# EasyEDA Pro project Force sensor PCB  Easy EDA Proffesional project.epro

# Schematic Schematic1
Create Date: 2025-01-10; Page Name: P1; Project Name: mcu_rs_485_force_sensor_leneralizer; Schematic Name: Schematic1; Update Date: 2025-01-26; Company: EasyEDA.com; Page Size: A4; Version: V1.0
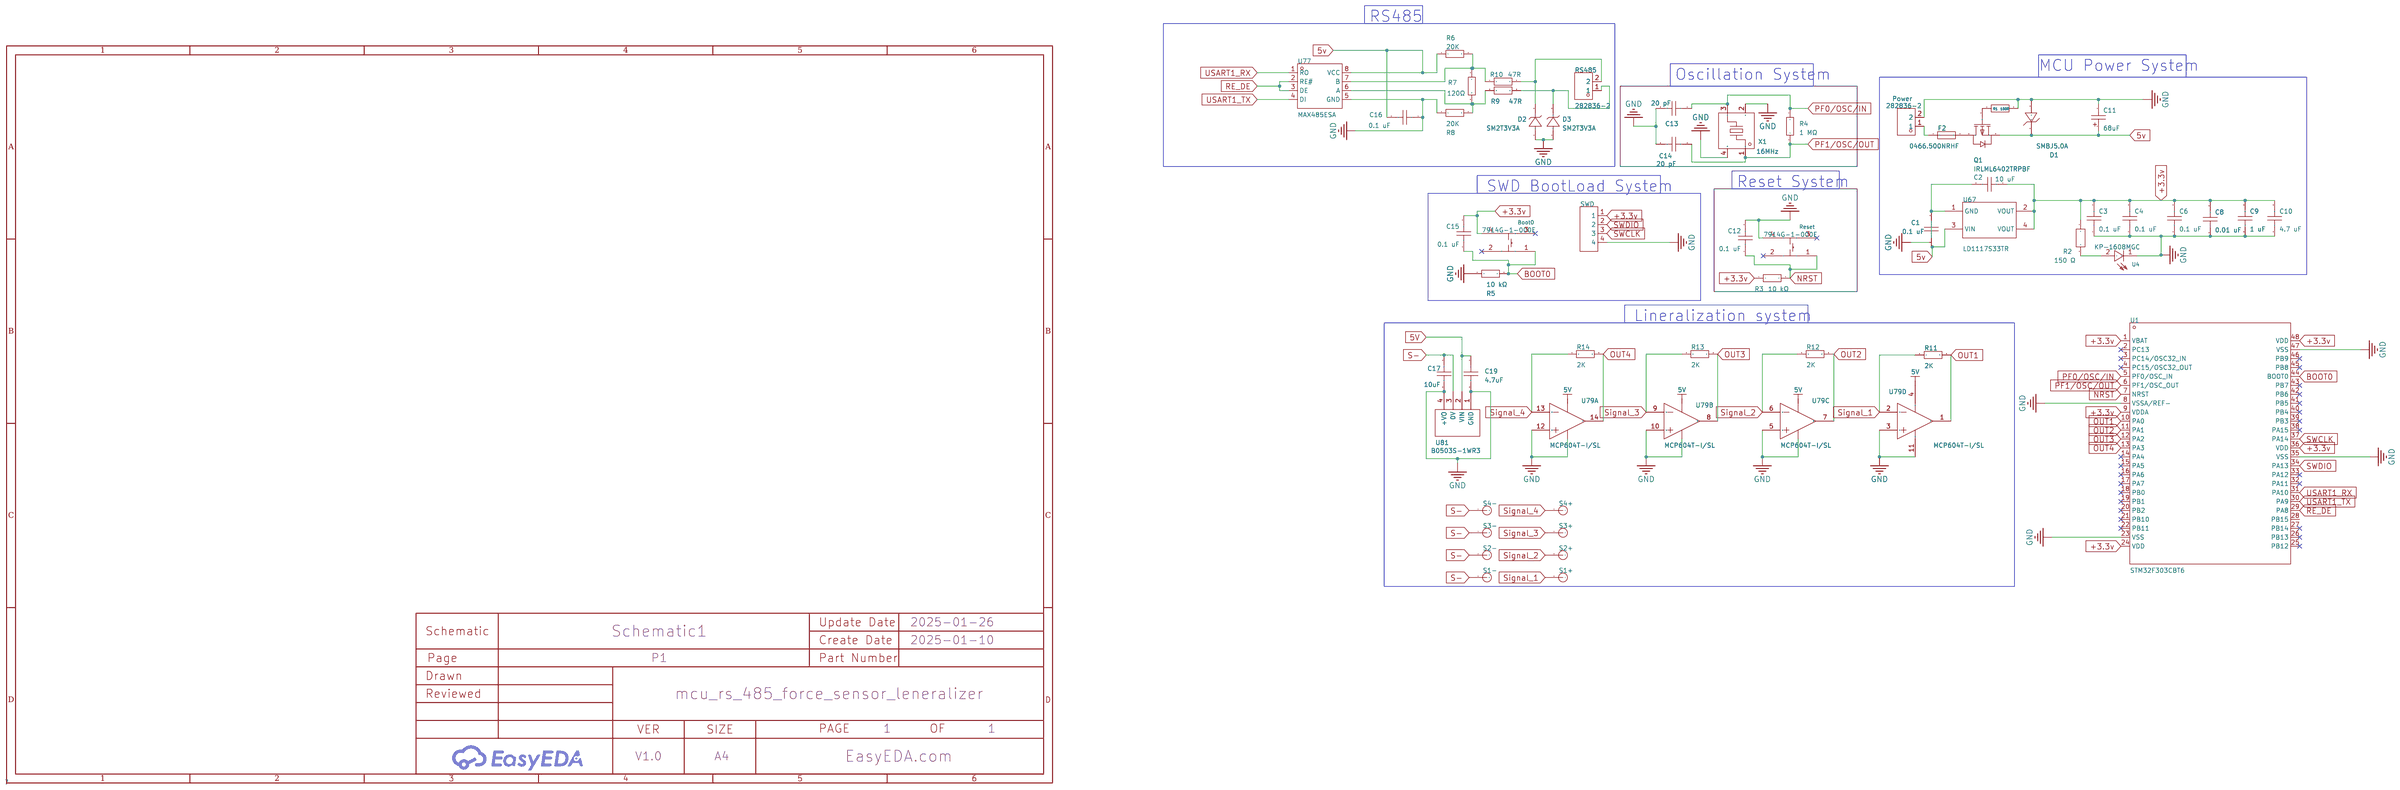
[diagram p0: schematic sheet]

## Parts
Boot0  7914G-1-000E  [KEY-SMD_4P-L5.0-W5.0-P2.54-LS5.5-BL]
C1  0.1 uF  [C0603]
C2  10 uF  [C0603]
C3  0.1 uF  [C0603]
C4  0.1 uF  [C0603]
C6  0.1 uF  [C0603]
C8  0.01 uF  [C0603]
C9  1 uF  [C0603]
C10  4.7 uF  [C0603]
C11  68uF  [CASE-B_3528]
C12  0.1 uF  [C0603]
C13  20 pF  [C0603]
C14  20 pF  [C0603]
C15  0.1 uF  [C0603]
C16  0.1 uF  [C0603]
C17  10uF  [C0603]
C19  4.7uF  [C0603]
D1  SMBJ5.0A  [SMB_L4.3-W3.6-LS5.4-RD]
D2  SM2T3V3A  [DO-216AA_L1.9-W1.9-LS3.8-FD]
D3  SM2T3V3A  [DO-216AA_L1.9-W1.9-LS3.8-FD]
F2  0466.500NRHF  [F1206]
Power  282836-2  [CONN-TH_2P-P5.00_282836-2]
Q1  IRLML6402TRPBF  [SOT-23-3_L2.9-W1.6-P1.90-LS2.8-BR]
R1  100R  [R0603]
R2  150 Ω  [R0805]
R3  10 kΩ  [R0603]
R4  1 MΩ  [R0603]
R5  10 kΩ  [R0603]
R6  20K  [R0603]
R7  120Ω  [R1206]
R8  20K  [R0603]
R9  47R  [R0603]
R10  47R  [R0603]
R11  2K  [R0603]
R12  2K  [R0603]
R13  2K  [R0603]
R14  2K  [R0603]
Reset  7914G-1-000E  [KEY-SMD_4P-L5.0-W5.0-P2.54-LS5.5-BL]
RS485  282836-2  [CONN-TH_2P-P5.00_282836-2]
S1+  -  [robust_pin]
S1-  -  [robust_pin]
S2+  -  [robust_pin]
S2-  -  [robust_pin]
S3+  -  [robust_pin]
S3-  -  [robust_pin]
S4+  -  [robust_pin]
S4-  -  [robust_pin]
SWD  -  [HDR-TH_4P-P2.54-V-M]
U1  STM32F303CBT6  [LQFP-48_L7.0-W7.0-P0.50-LS9.0-BL]
U4  KP-1608MGC  [LED0603-RD_GREEN]
U67  LD1117S33TR  [SOT-223_L6.5-W3.5-P2.30-LS7.0-BR]
U77  MAX485ESA  [SOIC-8_L4.9-W3.9-P1.27-LS6.0-BL]
U79  MCP604T-I/SL  [SOIC-14_L8.7-W3.9-P1.27-LS6.0-BL]  (sections 1,2,3,4)
U81  B0503S-1WR3  [PWRM-TH_B0503S-1WR2]
X1  16MHz  [CRYSTAL-SMD_4P-L5.0-W3.2-BL]

## Library data of the parts
Boot0 Reset = 7914G-1-000E: Circuit:SPST-常开 Actuator Style:Round Button Operating Force:300gf Mounting Style:Brick nogging Contact Current:100mA Voltage Rating (DC):16V IP Rating:IP67 Pin Style:Gull Wing Operating Temperature:-55℃~+125℃ Operating Temperature:-55℃~+125℃; Supplier Part: C840653; Manufacturer: BOURNS; JLCPCB Part Class: Extended Part; Supplier: LCSC; Circuit: SPST-常开; Actuator Style: Round Button; Operating Force: 300gf; Mounting Style: Brick nogging; Contact Current: 100mA; Voltage Rating (DC): 16V; IP Rating: IP67; Pin Style: Gull Wing; Operating Temperature: -55℃~+125℃
C1-C4 C6 C8-C10 C12-C17 C19 = CAP_0603: Supplier Footprint: 0603
C11 = TLJB227M006R0500: Capacitance: Tolerance:±20% Tolerance:±20% Rated Voltage: Equivalent Series Resistance(ESR):500mΩ@100kHz Operating Temperature:-55℃~+125℃ Operating Temperature:-55℃~+125℃; LCSC Part Name: 220uF ±20% 6.3V; Supplier Part: C30242; Manufacturer: Kyocera AVX; Supplier Footprint: CASE-B-3528-21(mm); JLCPCB Part Class: Extended Part; Datasheet: https://atta.szlcsc.com/upload/public/pdf/source/20181016/C313517_95E099C94D57B8A6005DAF15C3058A23.pdf; Supplier: LCSC; Tolerance: ±20%; Equivalent Series Resistance(ESR): 500mΩ@100kHz; Operating Temperature: -55℃~+125℃
D1 = SMBJ5.0A_C782420: Reverse Stand-Off Voltage (Vrwm):5V Maximum Clamping Voltage:9.2V Peak Pulse Current (Ipp)@10/1000us:65.3A Breakdown Voltage:6.4V Reverse Leakage Current (Ir):800uA Type:TVS; Supplier Part: C782420; Manufacturer: SEMBO(深波); Supplier Footprint: SMB(DO-214AA); JLCPCB Part Class: Extended Part; Datasheet: https://atta.szlcsc.com/upload/public/pdf/source/20200914/C782420_BB0DBCD40A47EBCD5666F735198E6B58.pdf; Supplier: LCSC; Reverse Stand-Off Voltage (Vrwm): 5V; Maximum Clamping Voltage: 9.2V; Peak Pulse Current (Ipp)@10/1000us: 65.3A; Breakdown Voltage: 6.4V; Reverse Leakage Current (Ir): 800uA; Type: TVS
D2 D3 = SM2T3V3A: Reverse Stand-Off Voltage (Vrwm):3.3V Maximum Clamping Voltage:6.8V Peak Pulse Current (Ipp)@10/1000us:25A Peak Pulse Power Dissipation (Ppp)@10/1000us:200W Breakdown Voltage:3.6V Reverse Leakage Current (Ir):500uA Type:TVS; LCSC Part Name: 单向TVS 3.3V截止 25A峰值脉冲; Supplier Part: C970557; Manufacturer: ST(意法半导体); Supplier Footprint: DO-216AA; JLCPCB Part Class: Extended Part; Datasheet: https://atta.szlcsc.com/upload/public/pdf/source/20201211/C970557_EBE10214B1FDEDE84815AE73A3ED0A7F.pdf; Supplier: LCSC; Reverse Stand-Off Voltage (Vrwm): 3.3V; Maximum Clamping Voltage: 6.8V; Peak Pulse Current (Ipp)@10/1000us: 25A; Peak Pulse Power Dissipation (Ppp)@10/1000us: 200W; Breakdown Voltage: 3.6V; Reverse Leakage Current (Ir): 500uA; Type: TVS
F2 = 0466.500NRHF: Type:SMD Fuse Current Rating:500mA Voltage Rating  (AC):63V Voltage Rating (DC):63V Operating Temperature:-55℃~+90℃ Operating Temperature:-55℃~+90℃ Breaking Capacity:50A; LCSC Part Name: 63V贴片式保险丝; Supplier Part: C151133; Manufacturer: Littelfuse(美国力特); Supplier Footprint: 1206; JLCPCB Part Class: Extended Part; Datasheet: https://atta.szlcsc.com/upload/public/pdf/source/20171201/C151136_15121178482301156393.pdf; Supplier: LCSC; Type: SMD Fuse; Current Rating: 500mA; Voltage Rating  (AC): 63V; Voltage Rating (DC): 63V; Operating Temperature: -55℃~+90℃; Breaking Capacity: 50A
Power RS485 = 282836-2: Pitch:5mm Color:Green Mounting Style:Direct Insert Current Rating (Max):13.5A Voltage Rating (Max):300V Number of Pins:2P Number of Rows:1 Wire Gauge - AWG:16~30 Wire Gauge - AWG:16~30 Number of PINs Per Row:2; LCSC Part Name: 5mm 排数:1 每排P数:2 直插; Supplier Part: C590402; Manufacturer: TE Connectivity(泰科电子); Supplier Footprint: 插件,P=5mm; JLCPCB Part Class: Extended Part; Datasheet: https://atta.szlcsc.com/upload/public/pdf/source/20240119/1DE6D9456CCE01F1F664469E3029A1B4.pdf; Supplier: LCSC; Pitch: 5mm; Color: Green; Mounting Style: Direct Insert; Current Rating (Max): 13.5A; Voltage Rating (Max): 300V; Number of Pins: 2P; Number of Rows: 1; Wire Gauge - AWG: 16~30; Number of PINs Per Row: 2
Q1 = IRLML6402TRPBF_C2593: Type:1 Piece P-Channel Drain Source Voltage (Vdss): Continuous Drain Current (Id): Drain Source On Resistance (RDS(on)@Vgs,Id):0.065Ω@4.5V,3.7A Power Dissipation (Pd): Gate Threshold Voltage (Vgs(th)@Id):0.55V@250uA Total Gate Charge (Qg@Vgs):12nC Input C; LCSC Part Name: 1个P沟道 耐压:20V 电流:3.7A; Supplier Part: C2593; Manufacturer: Infineon(英飞凌); Supplier Footprint: SOT-23; JLCPCB Part Class: Extended Part; Datasheet: https://atta.szlcsc.com/upload/public/pdf/source/20140818/1457707226203.pdf; Supplier: LCSC; Type: 1 Piece P-Channel; Drain Source On Resistance (RDS(on)@Vgs,Id): 0.065Ω@4.5V,3.7A; Gate Threshold Voltage (Vgs(th)@Id): 0.55V@250uA; Total Gate Charge (Qg@Vgs): 12nC; Input Capacitance (Ciss@Vds): 633pF; Reverse Transfer Capacitance (Crss@Vds): 110pF; Operating Temperature: -55℃~+150℃
R1 R3-R6 R8-R14 = Res_0603: Supplier Footprint: 0603
R2 = ERJ6ENF2053V: Type:Thick Film Resistors Resistance:205kΩ Tolerance:±1% Tolerance:±1% Power(Watts): Overload Voltage (Max):- Temperature Coefficient:±100ppm/℃ Temperature Coefficient:±100ppm/℃ Operating Temperature Range:-55℃~+155℃ Operating Temperature Range:-55℃~+155℃; LCSC Part Name: 205kΩ ±1% 125mW 厚膜电阻; Supplier Part: C2077507; Manufacturer: PANASONIC(松下); Supplier Footprint: 0805; JLCPCB Part Class: Extended Part; Datasheet: https://atta.szlcsc.com/upload/public/pdf/source/20240116/DC5257A3024E44D37E518C2D5EB5F78B.pdf; Supplier: LCSC; Type: Thick Film Resistors; Tolerance: ±1%; Temperature Coefficient: ±100ppm/℃; Operating Temperature Range: -55℃~+155℃
R7 = 1206W4J0121T5E: Type:Thick Film Resistors Resistance: Tolerance:±5% Tolerance:±5% Power(Watts): Overload Voltage (Max): Temperature Coefficient:±100ppm/℃ Temperature Coefficient:±100ppm/℃ Operating Temperature Range:-55℃~+155℃ Operating Temperature Range:-55℃~+155℃; LCSC Part Name: 120Ω ±5% 250mW 厚膜电阻; Supplier Part: C25351; Manufacturer: UNI-ROYAL(厚声); Supplier Footprint: 1206; JLCPCB Part Class: Extended Part; Datasheet: https://atta.szlcsc.com/upload/public/pdf/source/20200306/C422600_1E6D84923E4A46A82E41ADD87F860B5C.pdf; Supplier: LCSC; Type: Thick Film Resistors; Tolerance: ±5%; Temperature Coefficient: ±100ppm/℃; Operating Temperature Range: -55℃~+155℃
S1+ S1- S2+ S2- S3+ S3- S4+ S4- = robust_pin
SWD = HDR-M_2.54_1x4P: Supplier Footprint: Through
U1 = STM32F303CBT6: CPU Core:ARM-M4 CPU Maximum Speed:72MHz Program Storage Size:128KB Program Memory Type:FLASH Number of I/O:37 ADC (Bit):12bit DAC (Bit):12bit Low Voltage Detection Threshold:2V~3.6V Low Voltage Detection Threshold:2V~3.6V Application Area:-; LCSC Part Name: 带DSP和FPU的主流混合信号ARM Cortex-M4 MCU，具有128 KB Flash、72 MHz CPU、MPU、CCM、5 MSPS 12位ADC、PGA和比较器; Supplier Part: C108516; Manufacturer: ST(意法半导体); Supplier Footprint: LQFP-48(7x7); JLCPCB Part Class: Extended Part; Datasheet: https://atta.szlcsc.com/upload/public/pdf/source/20180517/C221513_0E93E775D15BCC140B342DE7CE77539F.pdf; Supplier: LCSC; CPU Core: ARM-M4; CPU Maximum Speed: 72MHz; Program Storage Size: 128KB; Program Memory Type: FLASH; Number of I/O: 37; ADC (Bit): 12bit; DAC (Bit): 12bit; Low Voltage Detection Threshold: 2V~3.6V
U4 = KP-1608MGC: Supplier Part: C598258; Manufacturer: Kingbright; Supplier Footprint: SMD; JLCPCB Part Class: Extended Part; Supplier: LCSC
U67 = LD1117S33TR: Output Type:Fixed Maximum Input Voltage:15V Output Voltage:3.3V Output Voltage:3.3V Output Current:800mA Power Supply Rejection Ratio (PSRR):75dB@(120Hz) Dropout Voltage:1.2V@(800mA) standby current:10mA Feature:Thermal Protection(TSD)；Overcurrent Protect; LCSC Part Name: 可调与固定低压降正电压稳压器; Supplier Part: C86781; Manufacturer: ST(意法半导体); Supplier Footprint: SOT-223; JLCPCB Part Class: Extended Part; Datasheet: https://atta.szlcsc.com/upload/public/pdf/source/20181022/C283467_00098992BB1D287195B66486CE33A2DD.pdf; Supplier: LCSC; Output Type: Fixed; Maximum Input Voltage: 15V; Output Voltage: 3.3V; Output Current: 800mA; Power Supply Rejection Ratio (PSRR): 75dB@(120Hz); Dropout Voltage: 1.2V@(800mA); standby current: 10mA; Feature: Thermal Protection(TSD)；Overcurrent Protection(OCP); Operating Temperature: 0℃~+125℃; Output Polarity: Positive electrode; Number of Outputs: 1
U77 = MAX485ESA_C5279041: Supplier Part: C5279041; Manufacturer: TWGMC(台湾迪嘉); Supplier Footprint: SOP-8; JLCPCB Part Class: Extended Part; Datasheet: https://atta.szlcsc.com/upload/public/pdf/source/20221123/28407831C9A9BE6EF87858D2D3D1ED55.pdf; Supplier: LCSC
U79 = MCP604T-I/SL: Number of Circuits:Quad Gain Bandwidth Product(GBP):2.8MHz Current - Input Bias(Ib):1pA Slew Rate(SR):2.3V/us Output Current:22mA Supply Voltage:2.7V~6V Supply Voltage:2.7V~6V -3db Bandwidth:- Output Type:- Rail to Rail:- Supply Current:230uA Operating Te; Supplier Part: C116582; Manufacturer: MICROCHIP(美国微芯); Supplier Footprint: SOIC-14; JLCPCB Part Class: Extended Part; Datasheet: https://atta.szlcsc.com/upload/public/pdf/source/20170914/C128440_1505359808468967969.pdf; Supplier: LCSC; Number of Circuits: Quad; Gain Bandwidth Product(GBP): 2.8MHz; Current - Input Bias(Ib): 1pA; Slew Rate(SR): 2.3V/us; Output Current: 22mA; Supply Voltage: 2.7V~6V; Supply Current: 230uA; Operating Temperature: -40℃~+85℃
U81 = B0503S-1WR3: Number of channel:1 Power:1W input voltage (Vdc):5V input voltage (Vdc):5V Conversion Efficiency:80% Conversion Efficiency:80% Output Voltage:3.3V Output Voltage:3.3V Output Current (Max):303mA Output Current (Max):303mA Maximum Capacitive Load:1000uF Ins; Supplier Part: C909801; Manufacturer: DEXU(德旭电子); Supplier Footprint: 插件; JLCPCB Part Class: Extended Part; Datasheet: https://atta.szlcsc.com/upload/public/pdf/source/20220506/5C724B602142C8CBB8B399A9C2923D8F.pdf; Supplier: LCSC; Number of channel: 1; Power: 1W; input voltage (Vdc): 5V; Conversion Efficiency: 80%; Output Voltage: 3.3V; Output Current (Max): 303mA; Maximum Capacitive Load: 1000uF; Insulated Voltage: 1500V
X1 = HY13MSMD50324POB1R10: Frequency: External load capacitor:20pF Frequency Stability(Full temperature range):±10ppm Frequency Stability(Full temperature range):±10ppm Equivalent Series Resistance (ESR):50Ω; LCSC Part Name: 13MHz 20pF; Supplier Part: C7275144; Manufacturer: Huiyuan crystal(惠源晶工); Supplier Footprint: SMD5032-4P; JLCPCB Part Class: Extended Part; Datasheet: https://atta.szlcsc.com/upload/public/pdf/source/20230530/D0430CADBE2CD60CA30268FC8461A922.pdf; Supplier: LCSC; External load capacitor: 20pF; Frequency Stability(Full temperature range): ±10ppm; Equivalent Series Resistance (ESR): 50Ω

## Nets
5v: C1.1 C11.1 C16.2 D1.1(C) Q1.2(S) R6.1 U67.3(VIN) U77.8(VCC)
5V: C19.1 U79.4(VDD) U81.2(VIN)
+3.3v: Boot0.4 C2.1 C3.2 C4.2 C6.2 C8.2 C9.2 C10.2 C15.2 R2.1 R3.1 SWD.1 U1.1(VBAT) U1.9(VDDA) U1.24(VDD) U1.36(VDD) U1.48(VDD) U67.2(VOUT) U67.4(VOUT)
GND: C1.2 C2.2 C3.1 C4.1 C6.1 C8.1 C9.1 C10.1 C11.2 C12.2 C13.2 C14.2 C16.1 C17.2 C19.2 D1.2(A) D2.1(A) D3.1(A) Power.2 R1.2 R5.1 R8.1 Reset.4 SWD.4 U1.8(VSSA/REF-) U1.23(VSS) U1.35(VSS) U1.47(VSS) U4.1(C) U67.1(GND) U77.5(GND) U79.3(VINA+) U79.5(VINB+) U79.10(VINC+) U79.11(VSS) U79.12(VIND+) U81.1(GND) U81.4(+VO) X1.2(GND) X1.4(GND)
BOOT0: Boot0.1 C15.1 R5.2 U1.44(BOOT0)
NRST: C12.1 R3.2 Reset.1 U1.7(NRST)
OUT1: R11.2 U1.10(PA0) U79.1(VOUTA)
OUT2: R12.2 U1.11(PA1) U79.7(VOUTB)
OUT3: R13.2 U1.12(PA2) U79.8(VOUTC)
OUT4: R14.2 U1.13(PA3) U79.14(VOUTD)
PF0/OSC/IN: C13.1 R4.1 U1.5(PF0/OSC_IN) X1.3
PF1/OSC/OUT: C14.1 R4.2 U1.6(PF1/OSC_OUT) X1.1
RE_DE: U1.29(PA8) U77.2(RE#) U77.3(DE)
S-: C17.1 S1-.1 S2-.1 S3-.1 S4-.1 U81.3(0V)
Signal_1: R11.1 S1+.1 U79.2(VINA-)
Signal_2: R12.1 S2+.1 U79.6(VINB-)
Signal_3: R13.1 S3+.1 U79.9(VINC-)
Signal_4: R14.1 S4+.1 U79.13(VIND-)
SWCLK: SWD.3 U1.37(PA14)
SWDIO: SWD.2 U1.34(PA13)
USART1_RX: U1.31(PA10) U77.1(RO)
USART1_TX: U1.30(PA9) U77.4(DI)
$1N1376: R2.2 U4.2(A)
$1N1378: F2.1 Power.1
$1N1384: Q1.1(G) R1.1
$1N2474: D2.2(K) R10.2 RS485.2
$1N2476: R7.2 R8.2 R9.1 U77.6(A)
$1N2482: D3.2(K) R9.2 RS485.1
$1N2483: R6.2 R7.1 R10.1 U77.7(B)
$1N9830: F2.2 Q1.3(D)

Not connected (* = marked no-connect by the designer): Boot0 2* 3*; Reset 2* 3*; U1 2(PC13)* 3(PC14/OSC32_IN)* 4(PC15/OSC32_OUT)* 14(PA4)* 15(PA5)* 16(PA6)* 17(PA7)* 18(PB0)* 19(PB1)* 20(PB2)* 21(PB10)* 22(PB11)* 25(PB12)* 26(PB13)* 27(PB14)* 28(PB15) 32(PA11)* 33(PA12)* 38(PA15)* 39(PB3)* 40(PB4)* 41(PB5)* 42(PB6)* 43(PB7)* 45(PB8)* 46(PB9)*

## Notes on the sheet
- RS485
- MCU Power System
- Oscillation System
- Reset System
- SWD BootLoad System
- Lineralization system

# Board PCB1
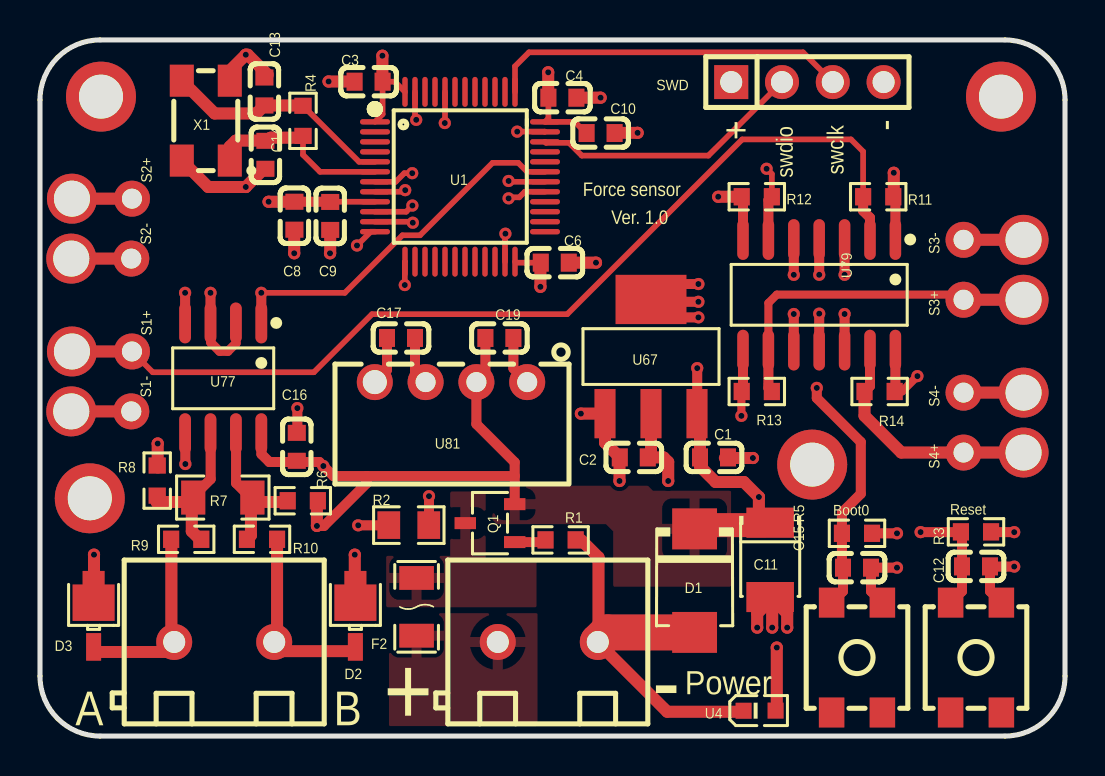
[diagram p1: board, top side]
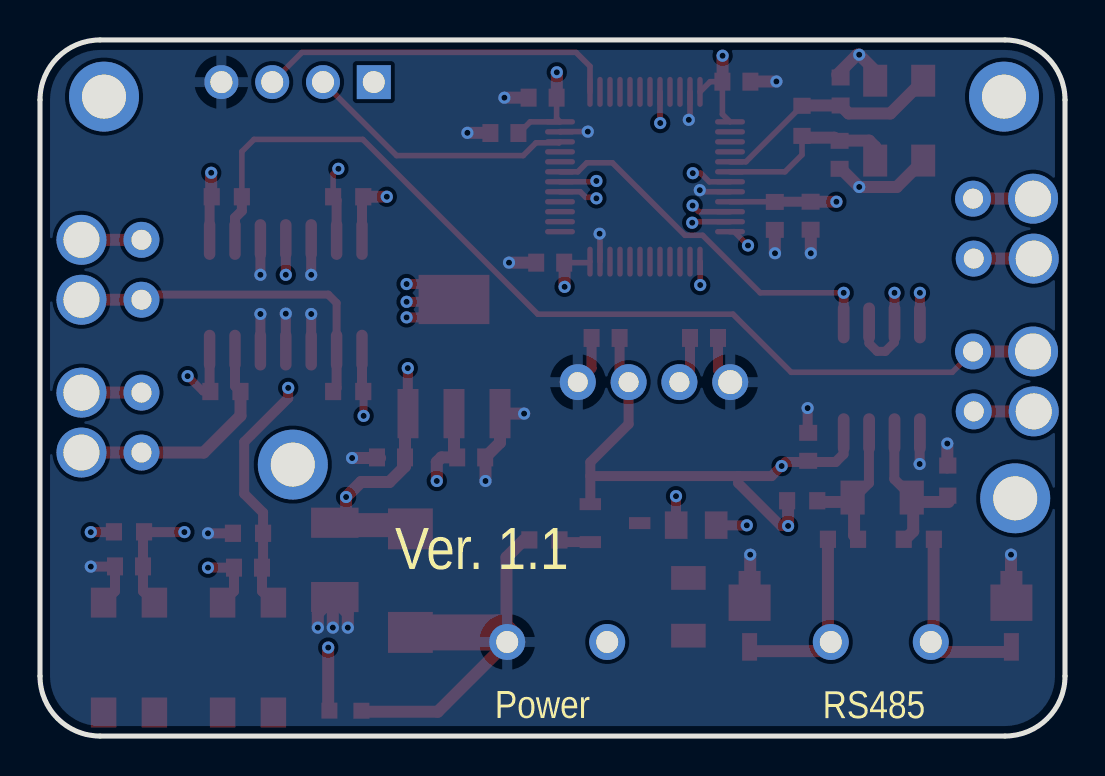
[diagram p2: board, bottom side, seen from below]

Outline 51.25 x 34.85 mm; copper layers: Top Layer, Inner1, Inner2, Bottom Layer. Coordinates in mm from the lower left corner of the outline.
Outline path: 0,31.85 0,3 arc(0.88,0.88) 3,0 48.25,0 arc(50.37,0.88) 51.25,3 51.25,31.85 arc(50.37,33.97) 48.25,34.85 3,34.85 arc(0.88,33.97) 0,31.85
Stack: Top Layer 0.035mm 外层铜厚1oz / Dielectric1 0.2104mm 7628 RC49% 8.6mil / Inner1 0.0152mm 内层铜厚 / Dielectric2 1.065mm 1.1mm H/HOZ 含铜 / Inner2 0.0152mm 内层铜厚 / Dielectric3 0.2104mm 7628 RC49% 8.6mil / Bottom Layer 0.035mm 外层铜厚1oz

## Design rules (mm)
template: JLCPCB Capability(Two Layers Board)
spacing copperThickness1oz (default): track to track 0.102, other pairs 0.152 to 0.3
spacing copperThickness2oz: track to track 0.203, other pairs 0.152 to 0.3
track width copperThickness1oz (default): min 0.127, default 0.254, max 2.54
track width copperThickness2oz: min 0.203, default 0.254, max 2.54
differential pair differentialPair (default): width min 0.127, default 0.254, max 2.54; gap min 0.152, default 0.152
via viaSize (default): diameter min 0.5, default 0.61, max 10; hole min 0.3, default 0.305, max 6.3

## Placement (name value [footprint] x y rotation side)
Boot0  7914G-1-000E  [KEY-SMD_4P-L5.0-W5.0-P2.54-LS5.5-BL]  40.85 3.93 270 top
C1  0.1 uF  [C0603]  33.7 13.95 0 top
C2  10 uF  [C0603]  29.69 13.95 180 top
C3  0.1 uF  [C0603]  16.43 32.76 0 top
C4  0.1 uF  [C0603]  26.12 31.96 180 top
C6  0.1 uF  [C0603]  25.74 23.7 180 top
C8  0.01 uF  [C0603]  12.72 26.05 90 top
C9  1 uF  [C0603]  14.51 26.04 90 top
C10  4.7 uF  [C0603]  28.03 30.19 180 top
C11  68uF  [CASE-B_3528]  36.51 8.82 270 top
C12  0.1 uF  [C0603]  46.8 8.49 0 top
C13  20 pF  [C0603]  11.22 32.27 90 top
C14  20 pF  [C0603]  11.27 29.1 270 top
C15  0.1 uF  [C0603]  40.85 8.43 0 top
C16  0.1 uF  [C0603]  12.84 14.48 270 top
C17  10uF  [C0603]  18.05 19.93 180 top
C19  4.7uF  [C0603]  22.97 19.93 0 top
D1  SMBJ5.0A  [smb_l4.3-w3.6-ls5.4-rd]  32.73 7.78 270 top
D2  SM2T3V3A  [DO-216AA_L1.9-W1.9-LS3.8-FD]  15.77 5.74 270 top
D3  SM2T3V3A  [DO-216AA_L1.9-W1.9-LS3.8-FD]  2.68 5.74 270 top
F2  0466.500NRHF  [f1206]  18.83 6.47 90 top
NOREF  -  [Pad_e2410]  3.05 32.01 0 top
NOREF#2  -  [Pad_e2411]  48.05 32.01 0 top
NOREF#3  -  [Pad_e2413]  38.61 13.59 0 top
NOREF#4  -  [Pad_e2412]  2.49 11.9 0 top
Power  282836-2  [conn-th_2p-p5.00_282836-2]  25.39 4.71 0 top
Q1  IRLML6402TRPBF  [sot-23-3_l2.9-w1.6-p1.90-ls2.8-br]  22.5 10.66 0 top
R1  100R  [R0603]  26.03 9.82 0 top
R2  150 Ω  [R0805]  18.44 10.56 0 top
R3  10 kΩ  [R0603]  46.8 10.22 180 top
R4  1 MΩ  [R0603]  13.15 30.8 270 top
R5  10 kΩ  [R0603]  40.85 10.15 180 top
R6  20K  [R0603]  13.14 11.78 180 top
R7  120Ω  [R1206]  9.14 11.94 180 top
R8  20K  [R0603]  5.86 12.79 270 top
R9  47R  [R0603]  7.31 9.85 180 top
R10  47R  [R0603]  11.1 9.85 0 top
R11  2K  [R0603]  41.91 27 0 top
R12  2K  [R0603]  35.84 27 180 top
R13  2K  [R0603]  35.84 17.25 180 top
R14  2K  [R0603]  41.98 17.25 0 top
Reset  7914G-1-000E  [KEY-SMD_4P-L5.0-W5.0-P2.54-LS5.5-BL]  46.8 3.93 270 top
RS485  282836-2  [CONN-TH_2P-P5.00_282836-2]  9.21 4.71 0 top
S1+  -  [robust_pin]  4.6 19.25 90 top
S1-  -  [robust_pin]  4.56 16.25 90 top
S2+  -  [robust_pin]  4.6 26.9 90 top
S2-  -  [robust_pin]  4.56 23.9 90 top
S3+  -  [robust_pin]  46.18 21.84 270 top
S3-  -  [robust_pin]  46.18 24.84 270 top
S4+  -  [robust_pin]  46.18 14.19 270 top
S4-  -  [robust_pin]  46.18 17.19 270 top
SWD  -  [hdr-th_4p-p2.54-v-m]  38.37 32.74 0 top
U1  STM32F303CBT6  [LQFP-48_L7.0-W7.0-P0.50-LS9.0-BL]  21 28 270 top
U4  KP-1608MGC  [LED0603-RD_GREEN]  35.98 1.27 0 top
U67  LD1117S33TR  [SOT-223_L6.5-W3.5-P2.30-LS7.0-BR]  30.55 19 270 top
U77  MAX485ESA  [SOIC-8_L4.9-W3.9-P1.27-LS6.0-BL]  9.16 17.91 180 top
U79  MCP604T-I/SL  [SOIC-14_L8.7-W3.9-P1.27-LS6.0-BL]  38.96 22.09 180 top
U81  B0503S-1WR3  [pwrm-th_b0503s-1wr2]  20.55 17.72 180 top
X1  16MHz  [CRYSTAL-SMD_4P-L5.0-W3.2-BL]  8.29 30.81 90 top

## Footprints (pads in the part's own frame, mm; a bottom-side part is the same pattern mirrored in y, then rotated)
C0603
  rect 0.8x0.9 smd: 1(-0.7,0) 2(0.7,0)
CASE-B_3528
  rect 1.506x2.376 smd: 1(-1.861,0) 2(1.861,0)
CONN-TH_2P-P5.00_282836-2
  round 1.8 hole 1.1: 1(-2.5,0) 2(2.5,0)
conn-th_2p-p5.00_282836-2
  round 1.8 hole 1.1: 1(-2.5,0) 2(2.5,0)
CRYSTAL-SMD_4P-L5.0-W3.2-BL
  rect 1.6x1.2 smd: 1(-2,-1.2) 2(2,-1.2) 3(2,1.2) 4(-2,1.2)
DO-216AA_L1.9-W1.9-LS3.8-FD
  custom 2.5x2.1 smd: 1(-1.276,0)
  rect 1.38x0.75 smd: 2(1.276,0)
f1206
  rect 1.19x1.728 smd: 1(-1.445,0) 2(1.445,0)
hdr-th_4p-p2.54-v-m
  rect 1.7x1.7 hole 1.1: 1(-3.81,0)
  round 1.7 hole 1.1: 2(-1.27,0) 3(1.27,0) 4(3.81,0)
KEY-SMD_4P-L5.0-W5.0-P2.54-LS5.5-BL
  rect 1.5x1.273 smd: 1(-2.75,-1.27) 2(2.75,-1.27) 3(2.75,1.27) 4(-2.75,1.27)
LED0603-RD_GREEN
  rect 0.8x0.8 smd: 1(-0.799,-0.004) 2(0.799,0.004)
LQFP-48_L7.0-W7.0-P0.50-LS9.0-BL
  oval 0.27x1.5 smd: 1(-2.75,-4.25) 2(-2.25,-4.25) 3(-1.75,-4.25) 4(-1.25,-4.25) 5(-0.75,-4.25) 6(-0.25,-4.25) 7(0.25,-4.25) 8(0.75,-4.25) 9(1.25,-4.25) 10(1.75,-4.25) 11(2.25,-4.25) 12(2.75,-4.25) 25(2.75,4.25) 26(2.25,4.25) 27(1.75,4.25) 28(1.25,4.25) 29(0.75,4.25) 30(0.25,4.25) 31(-0.25,4.25) 32(-0.75,4.25) 33(-1.25,4.25) 34(-1.75,4.25) 35(-2.25,4.25) 36(-2.75,4.25)
  oval 1.5x0.27 smd: 13(4.25,-2.75) 14(4.25,-2.25) 15(4.25,-1.75) 16(4.25,-1.25) 17(4.25,-0.75) 18(4.25,-0.25) 19(4.25,0.25) 20(4.25,0.75) 21(4.25,1.25) 22(4.25,1.75) 23(4.25,2.25) 24(4.25,2.75) 37(-4.25,2.75) 38(-4.25,2.25) 39(-4.25,1.75) 40(-4.25,1.25) 41(-4.25,0.75) 42(-4.25,0.25) 43(-4.25,-0.25) 44(-4.25,-0.75) 45(-4.25,-1.25) 46(-4.25,-1.75) 47(-4.25,-2.25) 48(-4.25,-2.75)
Pad_e2410
  round 3.5 hole 2.2: 65(0,0)
Pad_e2411
  round 3.5 hole 2.2: 65(0,0)
Pad_e2412
  round 3.5 hole 2.2: 65(0,0)
Pad_e2413
  round 3.5 hole 2.2: 65(0,0)
pwrm-th_b0503s-1wr2
  round 1.8 hole 1: 1(-3.81,0) 2(-1.27,0) 3(1.27,0)
  round 1.8 hole 1.2: 4(3.81,0)
R0603
  rect 0.806x0.864 smd: 1(-0.753,0) 2(0.753,0)
R0805
  rect 1.133x1.377 smd: 1(-1,0) 2(1,0)
R1206
  rect 1.208x1.701 smd: 1(-1.479,0) 2(1.479,0)
robust_pin
  round 2.5 hole 1.8x1.55: 1(0,3)
  round 1.8 hole 1: 2(0,0)
smb_l4.3-w3.6-ls5.4-rd
  rect 2.047x2.241 smd: 1(-2.591,0) 2(2.591,0)
SOIC-8_L4.9-W3.9-P1.27-LS6.0-BL
  oval 0.588x2.045 smd: 1(-1.905,-2.772) 2(-0.635,-2.772) 3(0.635,-2.772) 4(1.905,-2.772) 5(1.905,2.772) 6(0.635,2.772) 7(-0.635,2.772) 8(-1.905,2.772)
SOIC-14_L8.7-W3.9-P1.27-LS6.0-BL
  oval 0.574x2.038 smd: 1(-3.81,-2.769) 2(-2.54,-2.769) 3(-1.27,-2.769) 4(0,-2.769) 5(1.27,-2.769) 6(2.54,-2.769) 7(3.81,-2.769) 8(3.81,2.769) 9(2.54,2.769) 10(1.27,2.769) 11(0,2.769) 12(-1.27,2.769) 13(-2.54,2.769) 14(-3.81,2.769)
sot-23-3_l2.9-w1.6-p1.90-ls2.8-br
  rect 1.07x0.6 smd: 1(1.235,-0.95) 2(1.235,0.95) 3(-1.235,0)
SOT-223_L6.5-W3.5-P2.30-LS7.0-BR
  rect 2.465x1.05 smd: 1(2.857,-2.3) 2(2.857,0) 3(2.857,2.3)
  rect 2.465x3.54 smd: 4(-2.857,0)

## Nets
5V: C1.1 C11.1 C16.2 C19.1 D1.1 Q1.2 R6.1 U67.3 U77.8 U79.4 U81.2
+3.3V: Boot0.4 C2.1 C3.2 C4.2 C6.2 C8.2 C9.2 C10.2 C15.2 R2.1 R3.1 SWD.1 U1.1 U1.9 U1.24 U1.36 U1.48 U67.2 U67.4
GND: C1.2 C2.2 C3.1 C4.1 C6.1 C8.1 C9.1 C10.1 C11.2 C12.2 C13.2 C14.2 C16.1 C17.2 C19.2 D1.2 D2.1 D3.1 Power.2 R1.2 R5.1 R8.1 Reset.4 SWD.4 U1.8 U1.23 U1.35 U1.47 U4.1 U67.1 U77.5 U79.3 U79.5 U79.10 U79.11 U79.12 U81.1 U81.4 X1.2 X1.4
BOOT0: Boot0.1 C15.1 R5.2 U1.44
NRST: C12.1 R3.2 Reset.1 U1.7
OUT1: R11.2 U1.10 U79.1
OUT2: R12.2 U1.11 U79.7
OUT3: R13.2 U1.12 U79.8
OUT4: R14.2 U1.13 U79.14
PF0/OSC/IN: C13.1 R4.1 U1.5 X1.3
PF1/OSC/OUT: C14.1 R4.2 U1.6 X1.1
RE_DE: U1.29 U77.2 U77.3
S-: C17.1 S1-.1 S1-.2 S2-.1 S2-.2 S3-.1 S3-.2 S4-.1 S4-.2 U81.3
SIGNAL_1: R11.1 S1+.1 S1+.2 U79.2
SIGNAL_2: R12.1 S2+.1 S2+.2 U79.6
SIGNAL_3: R13.1 S3+.1 S3+.2 U79.9
SIGNAL_4: R14.1 S4+.1 S4+.2 U79.13
SWCLK: SWD.3 U1.37
SWDIO: SWD.2 U1.34
USART1_RX: U1.31 U77.1
USART1_TX: U1.30 U77.4
$1N1376: R2.2 U4.2
$1N1378: F2.1 Power.1
$1N1384: Q1.1 R1.1
$1N2474: D2.2 R10.2 RS485.2
$1N2476: R7.2 R8.2 R9.1 U77.6
$1N2482: D3.2 R9.2 RS485.1
$1N2483: R6.2 R7.1 R10.1 U77.7
$1N9830: F2.2 Q1.3

Pads without a net: Boot0 2 3; NOREF 65; NOREF#2 65; NOREF#3 65; NOREF#4 65; Reset 2 3; U1 2 3 4 14 15 16 17 18 19 20 21 22 25 26 27 28 32 33 38 39 40 41 42 43 45 46

## Via types
v1: diameter 0.61, hole 0.305, Top Layer to Bottom Layer, 66 vias

## Routing (per net, layer and track width the routed paths; a pad name or vN(x,y) marks a point on that pad's centre or on a via; arc(x,y) is an arc through that point)
5V: length 53
  Top Layer w0.5: v1(32.86,18.42) 32.86,16.15 U67.3 ; 11.07,15.15 11.07,14.11 11.47,13.72 13.97,13.72 v1(14.17,13.52) 14.67,13.02 16.34,13.02 ; 23.74,13.02 23.74,13.7 21.82,15.62 U81.2 22.27,18.17 C19.1 ; 23.74,13.02 Q1.2 ; 23.74,13.02 16.34,13.02 ; 16.34,13.02 16.34,12.66 14.2,10.52 v1(13.85,10.52) ; U79.4 v1(38.96,23.09)
  Top Layer w0.6: 36.69,10.87 C11.1 ; U67.3 33,15.99 C1.1 33,13.5 33.78,12.72 35.19,12.72 v1(35.94,11.97) 35.94,11.27 36.45,10.77 ; 13.85,11.72 v1(13.85,10.52)
  Top Layer w0.8: 32.7,10.56 32.49,10.77 ; 36.45,10.77 36.24,10.56
  Top Layer w1.2: 36.24,10.56 32.7,10.56
  Inner2 w0.5: v1(38.96,23.09) 37.94,22.07 35.79,22.07 32.86,19.14 v1(32.86,18.42)
+3.3V: length 35.7
  Top Layer w0.28: U1.1 17.13,31.13 C3.2 17.74,32.76 U1.48 ; C4.2 25.42,30.92 U1.36 26.74,30.75 27.29,30.2 ; C6.2 23.8,23.7 U1.24 ; C9.2 14.52,26.75 U1.9
  Top Layer w0.5: 30.82,21.59 30.97,21.74 32.95,21.74 ; 30.82,21.59 U67.4 30.41,22 31.04,22.63 v1(32.92,22.63) ; 30.82,21.59 31.45,20.96 32.93,20.96 ; C9.2 14.5,26.75 C8.2 ; v1(15.91,10.55) 17.43,10.55 R2.1 ; v1(42.85,8.43) C15.2 41.55,7.25 Boot0.4 ; v1(48.71,10.21) 47.57,10.21 R3.1
  Top Layer w0.6: C6.2 25.02,23.68 v1(25.02,22.49) ; C4.2 25.41,31.97 v1(25.41,33.23) ; U67.2 30.55,14.11 C2.1 31.18,13.95 31.41,13.72 v1(31.41,12.77) ; C3.2 17.12,32.77 v1(17.12,34.06) ; v1(11.43,26.75) C8.2
  vias: v1(32.92,21.74) v1(32.92,20.96)
GND: length 78.2
  Top Layer w0.28: v1(23.27,25.15) 23.25,25.13 U1.23 ; U1.8 18.18,27.25 v1(18.26,27.33) ; v1(23.86,30.26) 25.24,30.26 U1.35 ; U1.47 18.75,30.91 v1(18.81,30.85)
  Top Layer w0.5: v1(12.87,16.42) 12.87,15.12 ; v1(37.69,23.09) U79.5 ; U79.10 v1(37.69,21.13) ; 7.26,15.15 7.27,15.14 v1(7.27,13.62) ; C19.2 23.67,18.41 U81.1 ; v1(48.71,8.48) 47.51,8.48 C12.2 47.5,7.25 Reset.4 ; v1(42.85,10.15) R5.1 ; U81.4 17.35,18.33 C17.2 ; U79.11 v1(38.96,21.15) ; U79.3 v1(40.23,23.09) ; U79.12 v1(40.23,21.13)
  Top Layer w0.6: 27.93,4.75 27.93,8.95 27.05,9.82 ; 27.93,4.75 27.93,4.65 31.36,1.22 35.22,1.22 ; 27.93,4.75 Power.2 ; v1(5.89,14.64) 5.89,13.44 ; v1(36.61,5.43) 36.61,6.89 ; 36.61,6.89 35.86,6.14 v1(35.86,5.43) ; 36.61,6.89 37.36,6.14 v1(37.36,5.43) ; v1(29.88,30.2) 28.69,30.2 ; 34.25,13.92 v1(35.65,13.92) ; v1(14.43,32.77) 15.72,32.77 C3.1 ; v1(27.04,16.14) U67.1 28.25,14.69 C2.2 28.97,13.94 v1(28.97,12.77) ; C9.1 14.51,24.18 v1(14.5,24.17) ; v1(2.7,9.08) 2.7,7.04 D3.1 ; X1.4 8.41,27.49 v1(10.29,27.49) 11.21,28.41 11.39,28.41 ; v1(12.71,24.17) 12.71,25.34 C8.1 ; X1.2 9.49,33.31 v1(10.29,34.11) 10.39,34.11 11.39,33.11 ; v1(15.74,9.08) 15.74,7.59 15.71,7.59 ; v1(27.8,23.7) C6.1 ; v1(28.03,31.96) C4.1
  Top Layer w1.8: D1.2 28.37,5.19 27.93,4.75
BOOT0: length 51.3
  Top Layer w0.28: v1(20.24,30.69) 20.25,30.7 U1.44
  Top Layer w0.5: v1(38.84,17.43) 38.84,16.92 41.04,14.72 41.04,12.13 40.1,11.19 R5.2 40.1,8.48 C15.1 40.15,7.25 Boot0.1
  Inner2 w0.5: v1(20.24,30.69) 21.88,30.69 23.22,29.35 42.81,29.35 43.64,28.52 43.64,23.43 38.84,18.63 v1(38.84,17.43)
NRST: length 65.5
  Top Layer w0.28: v1(18.61,28.18) 18.21,28.18 17.78,27.75 U1.7
  Top Layer w0.5: Reset.1 46.1,7.25 C12.1 46.1,10.17 R3.2 46.03,10.21 v1(44.03,10.21)
  Inner2 w0.5: v1(44.03,10.21) 44.03,8.23 38.99,3.19 21.8,3.19 17.95,7.04 17.95,13.45 13.67,17.73 13.67,24.88 16.97,28.18 v1(18.61,28.18)
OUT1: length 31.1
  Top Layer w0.28: v1(18.62,26.56) 18.31,26.25 U1.10
  Top Layer w0.5: R11.2 42.77,26.89 U79.1
  Top Layer w0.6: R11.2 42.69,27.03 v1(42.69,28.2)
  Inner2 w0.5: v1(18.62,26.56) 19.18,26.56 19.74,26 31.35,26 33.29,27.94 35,27.94 35.58,27.36 41.85,27.36 v1(42.69,28.2)
OUT2: length 23
  Top Layer w0.28: U1.11 18.59,25.75 v1(18.64,25.7)
  Top Layer w0.5: R12.2 35.15,26.94 U79.7
  Top Layer w0.6: v1(33.91,27) R12.2
  Inner2 w0.5: v1(18.64,25.7) 21.02,23.32 23.71,23.32 25.11,24.72 31.63,24.72 v1(33.91,27)
OUT3: length 29.8
  Top Layer w0.28: U1.12 16.54,25.25 v1(15.85,24.56)
  Top Layer w0.4: v1(35.07,16.03) 35.07,17.23 R13.2
  Top Layer w0.5: U79.8 35.15,17.31 R13.2
  Inner2 w0.28: v1(35.07,16.03) 28.75,16.03 25.48,19.3 16.79,19.3 15.85,20.24 v1(15.85,24.56)
OUT4: length 34.4
  Top Layer w0.28: v1(18.24,22.58) 18.24,23.74 U1.13
  Top Layer w0.4: v1(43.87,18.02) 43.1,17.25 R14.2
  Top Layer w0.5: U79.14 42.77,17.29 R14.2
  Inner2 w0.28: v1(43.87,18.02) 42.63,16.78 28.72,16.78 25.37,20.13 18.75,20.13 18.24,20.64 v1(18.24,22.58)
PF0/OSC/IN: length 11.7
  Top Layer w0.28: U1.5 15.95,28.75 R4.1
  Top Layer w0.6: X1.3 8.73,31.17 10.82,31.17 C13.1 13.13,31.57 R4.1
PF1/OSC/OUT: length 9.4
  Top Layer w0.28: 13.15,29.96 13.15,29.1 14,28.25 U1.6
  Top Layer w0.6: X1.1 9.49,29.51 9.79,29.81 11.39,29.81 11.54,29.96 13.19,29.96
RE_DE: length 25.5
  Top Layer w0.28: U1.29 24.24,27.25 23.96,26.97 23.48,26.97 v1(23.43,26.92)
  Top Layer w0.45: 9.8,20.69 9.8,19.67 9.39,19.26 8.98,19.26 8.53,19.71 8.53,20.69
  Top Layer w0.5: v1(8.53,22.19) U77.3
  Inner2 w0.28: v1(23.43,26.92) 21.57,28.78 15.12,28.78 v1(8.53,22.19)
S-: length 84.9
  Top Layer w0.5: C17.1 18.75,18.25 U81.3
  Top Layer w0.6: S2-.1 S2-.2 ; S3-.1 S3-.2 ; S1-.1 S1-.2 ; S4-.1 S4-.2
  Inner1 w0.5: S2-.2 4.98,23.49 4.98,21.48 6.39,20.07 6.39,18.08 S1-.2 9.31,16.25 10.41,15.15 16.71,15.15 U81.3
  Inner2 w0.5: U81.3 29.76,7.24 36.17,7.24 46.12,17.19 S4-.2 44.42,18.95 44.42,24.06 45.2,24.84 S3-.2
SIGNAL_1: length 49.6
  Top Layer w0.28: S1+.2 5.64,18.21 13.69,18.21 16.6,21.12 26.36,21.12 35.11,29.87 40.55,29.87 41.16,29.26 R11.1
  Top Layer w0.5: U79.2 41.5,25.95 41.16,26.29 R11.1
  Top Layer w0.6: S1+.1 S1+.2
SIGNAL_2: length 41.7
  Top Layer w0.28: v1(36.33,28.4) 36.59,28.14 R12.1
  Top Layer w0.5: R12.1 36.42,26.83 U79.6
  Top Layer w0.6: S2+.1 S2+.2
  Inner1 w0.6: v1(36.33,28.4) 30.01,28.4 25.29,23.68 18.83,23.68 16.83,25.68 5.82,25.68 S2+.2
SIGNAL_3: length 17.5
  Top Layer w0.4: U79.9 36.42,21.68 36.84,22.1 45.92,22.1 S3+.2
  Top Layer w0.5: U79.9 36.42,17.42 R13.1
  Top Layer w0.6: S3+.1 S3+.2
SIGNAL_4: length 12.1
  Top Layer w0.5: R14.1 41.5,17.52 U79.13
  Top Layer w0.6: R14.1 41.23,16.03 43.07,14.19 S4+.2 S4+.1
SWCLK: length 18.1
  Top Layer w0.28: SWD.3 38.15,34.23 24.45,34.23 23.75,33.53 U1.37
SWDIO: length 13.7
  Top Layer w0.28: U1.34 25.3,29.7 26.45,29.7 27.09,29.06 33.42,29.06 SWD.2
USART1_RX: length 18.6
  Top Layer w0.28: v1(11.06,22.19) 15.24,22.19 18.12,25.07 19,25.07 22.63,28.7 23.91,28.7 24.36,28.25 U1.31
  Top Layer w0.5: v1(11.06,22.19) U77.1
USART1_TX: length 25.4
  Top Layer w0.28: v1(23.43,27.79) 23.47,27.75 U1.30
  Top Layer w0.5: v1(7.25,22.19) U77.4
  Inner2 w0.28: v1(7.25,22.19) 9.39,24.33 9.39,28.23 10.49,29.33 21.89,29.33 v1(23.43,27.79)
$1N1376: length 25.2
  Top Layer w0.5: R2.2 19.45,10.57 v1(19.45,12.01)
  Top Layer w0.6: v1(36.84,4.43) 36.84,1.24 36.82,1.22
  Inner2 w0.5: v1(36.84,4.43) 34.23,4.43 32.45,6.21 25.25,6.21 v1(19.45,12.01)
$1N1384: length 1.6
  Top Layer w0.5: R1.1 25.17,9.71 Q1.1
$1N2474: length 9.5
  Top Layer w0.6: R10.2 11.85,4.85 RS485.2 12.17,4.25 15.56,4.25 D2.2
$1N2476: length 7.7
  Top Layer w0.5: 8.53,15.15 8.53,12.86 7.59,11.92
  Top Layer w0.6: 8.02,9.82 7.59,10.25 7.59,11.92 7.39,11.72 5.82,11.72
$1N2482: length 9.6
  Top Layer w0.6: 6.52,9.82 6.57,9.77 6.57,4.21 2.93,4.21 D3.2
$1N2483: length 7.6
  Top Layer w0.5: 9.8,15.15 9.8,12.66 10.55,11.92
  Top Layer w0.6: 10.31,9.82 10.55,10.05 10.55,11.92 10.75,11.72 12.34,11.72

## Copper pours and planes (outline as drawn; the poured copper is in the pictures)
5V on Top Layer: 34.55,12.28 34.55,7.48 28.69,7.48 28.66,7.51 28.66,10.25 28.3,10.61 22.85,10.61 22.62,10.84 22.62,12.53 30.4,12.53 30.65,12.28
+3.3V on Inner1: 0,35.12 51.43,35.12 51.43,0 0,0
GND on Bottom Layer: 0,34.88 51.43,34.88 51.43,0 0,0
$1N1378 on Top Layer: 24.88,0.3 17.45,0.3 17.45,6.15 24.88,6.15
$1N9830 on Top Layer: 24.83,6.45 17.31,6.45 17.31,9.02 20.51,9.02 20.51,12.24 22.28,12.24 22.28,8.81 24.83,8.81

## Text on the board
Bottom Silkscreen Layer: RS485 | Power | Ver. 1.1
Top Silkscreen Layer: Force sensor | Ver. 1.0 | swdio | swclk | + | - | A | B
